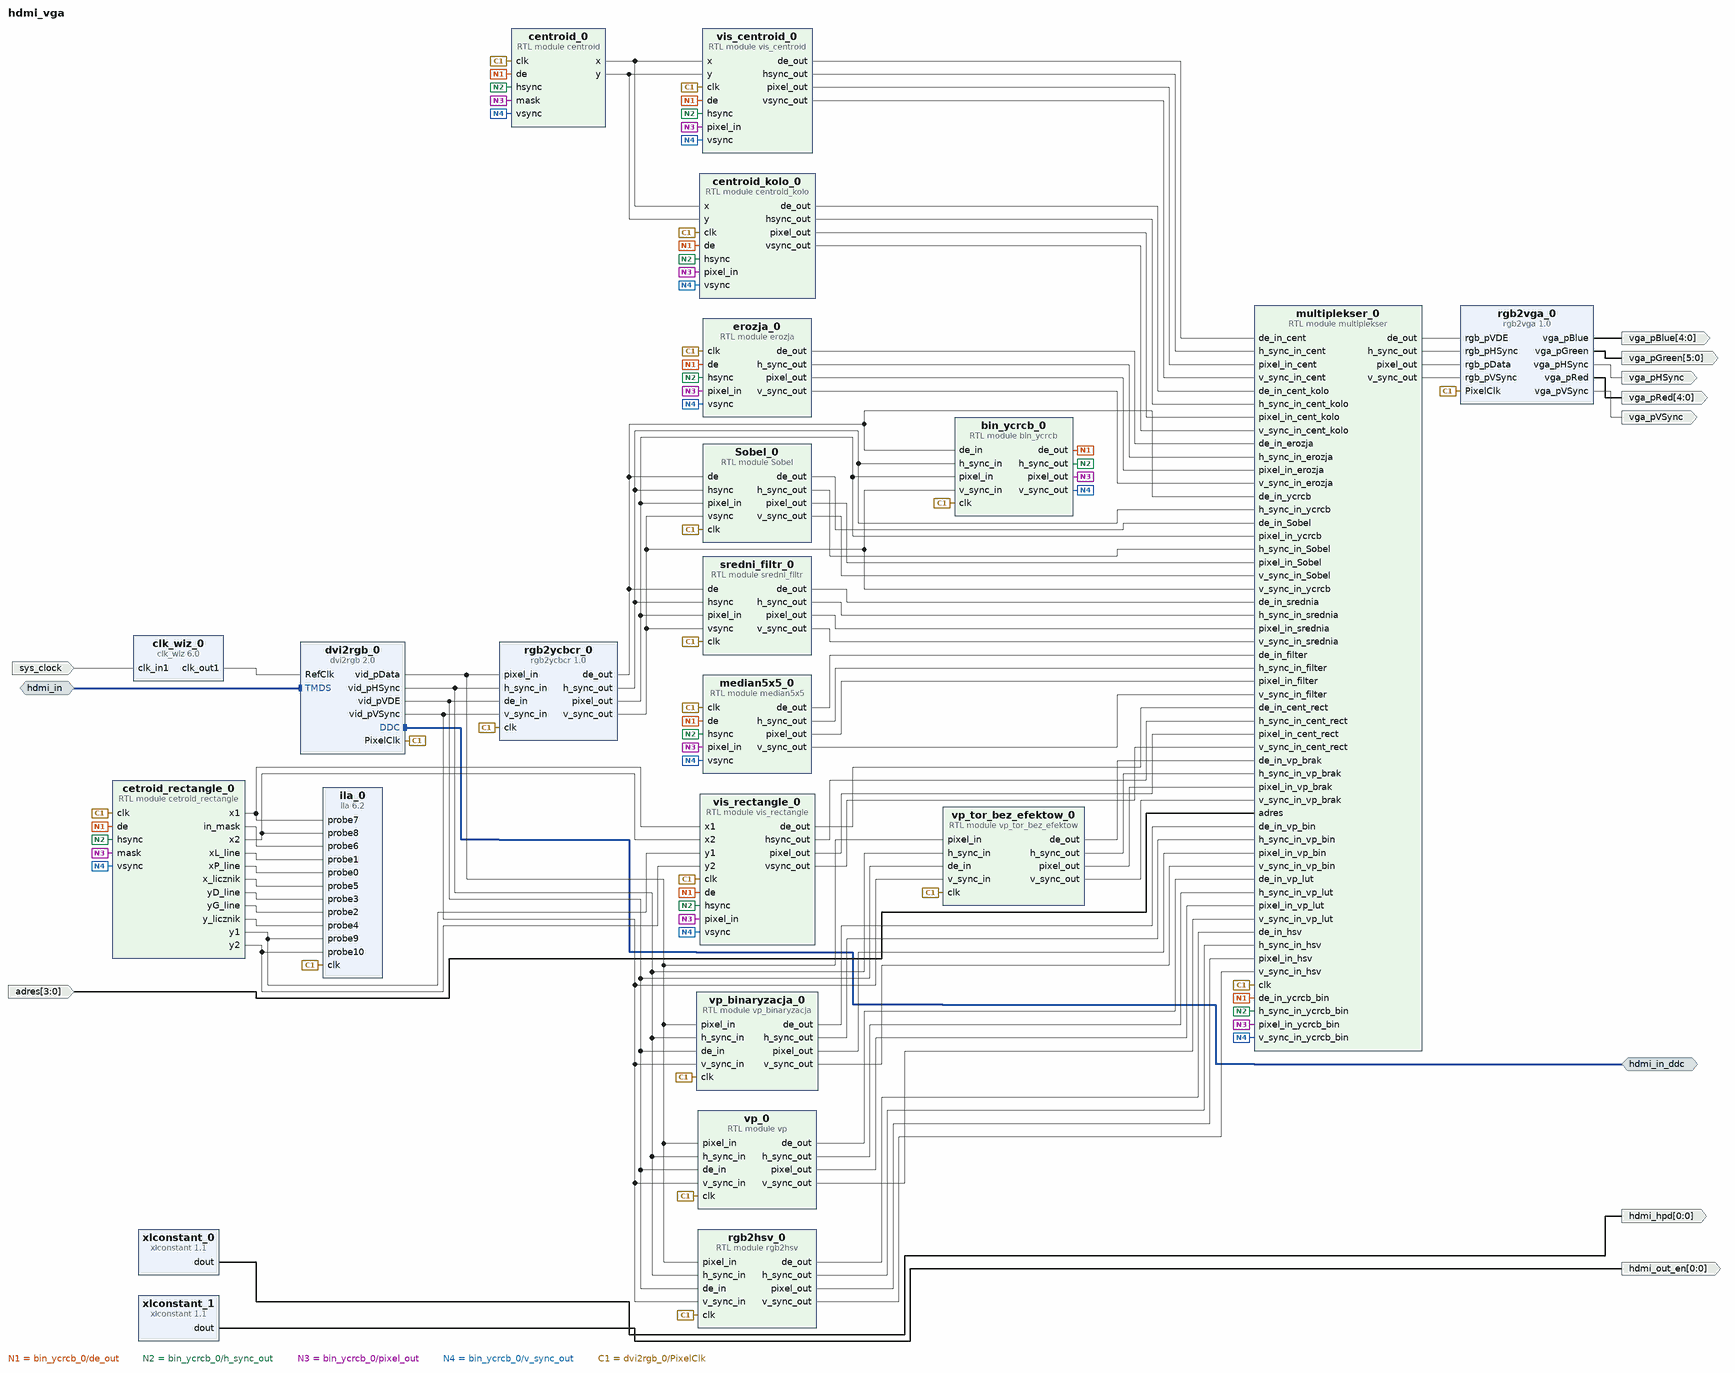
[diagram p0: block diagram of the top level]
# Vivado block design hdmi_vga, xc7z010clg400-1, Vivado 2022.2
create_bd_design hdmi_vga

create_bd_intf_port -mode Slave -vlnv digilentinc.com:interface:tmds_rtl:1.0 hdmi_in
create_bd_intf_port -mode Master -vlnv xilinx.com:interface:iic_rtl:1.0 hdmi_in_ddc
create_bd_port -dir I -type clk sys_clock
set_property -dict {CONFIG.FREQ_HZ 125000000} [get_bd_ports sys_clock]
create_bd_port -dir O -from 4 -to 0 vga_pRed
create_bd_port -dir O -from 5 -to 0 vga_pGreen
create_bd_port -dir O -from 4 -to 0 vga_pBlue
create_bd_port -dir O vga_pHSync
create_bd_port -dir O vga_pVSync
create_bd_port -dir O -from 0 -to 0 hdmi_hpd
create_bd_port -dir O -from 0 -to 0 hdmi_out_en
create_bd_port -dir I -from 3 -to 0 -type data adres

create_bd_cell -type ip -vlnv digilentinc.com:ip:dvi2rgb:2.0 dvi2rgb_0
create_bd_cell -type ip -vlnv xilinx.com:ip:clk_wiz:6.0 clk_wiz_0
set_property -dict [list \
  CONFIG.CLKOUT1_DRIVES BUFG \
  CONFIG.CLKOUT1_JITTER 109.241 \
  CONFIG.CLKOUT1_PHASE_ERROR 96.948 \
  CONFIG.CLKOUT1_REQUESTED_OUT_FREQ 200.000 \
  CONFIG.CLKOUT2_DRIVES BUFG \
  CONFIG.CLKOUT3_DRIVES BUFG \
  CONFIG.CLKOUT4_DRIVES BUFG \
  CONFIG.CLKOUT5_DRIVES BUFG \
  CONFIG.CLKOUT6_DRIVES BUFG \
  CONFIG.CLKOUT7_DRIVES BUFG \
  CONFIG.MMCM_BANDWIDTH OPTIMIZED \
  CONFIG.MMCM_CLKFBOUT_MULT_F 8 \
  CONFIG.MMCM_CLKOUT0_DIVIDE_F 5 \
  CONFIG.MMCM_COMPENSATION ZHOLD \
  CONFIG.PRIMITIVE PLL \
  CONFIG.USE_LOCKED false \
  CONFIG.USE_RESET false \
] [get_bd_cells clk_wiz_0]
create_bd_cell -type ip -vlnv digilentinc.com:ip:rgb2vga:1.0 rgb2vga_0
create_bd_cell -type ip -vlnv xilinx.com:ip:xlconstant:1.1 xlconstant_0
create_bd_cell -type ip -vlnv xilinx.com:ip:xlconstant:1.1 xlconstant_1
set_property -dict {CONFIG.CONST_VAL 0} [get_bd_cells xlconstant_1]
create_bd_cell -type module -reference vp vp_0
create_bd_cell -type module -reference vp_tor_bez_efektow vp_tor_bez_efektow_0
create_bd_cell -type module -reference vp_binaryzacja vp_binaryzacja_0
create_bd_cell -type ip -vlnv xilinx.com:user:rgb2ycbcr:1.0 rgb2ycbcr_0
create_bd_cell -type module -reference vis_centroid vis_centroid_0
set_property -dict {CONFIG.IMG_H 720 CONFIG.IMG_W 1280} [get_bd_cells vis_centroid_0]
create_bd_cell -type module -reference centroid centroid_0
set_property -dict {CONFIG.IMG_H 720 CONFIG.IMG_W 1280} [get_bd_cells centroid_0]
create_bd_cell -type module -reference centroid_kolo centroid_kolo_0
set_property -dict {CONFIG.IMG_H 720 CONFIG.IMG_W 1280 CONFIG.RADIUS 15 CONFIG.RADIUS_POWER2 225} [get_bd_cells centroid_kolo_0]
create_bd_cell -type module -reference vis_rectangle vis_rectangle_0
set_property -dict {CONFIG.IMG_H 720 CONFIG.IMG_W 1280} [get_bd_cells vis_rectangle_0]
create_bd_cell -type ip -vlnv xilinx.com:ip:ila:6.2 ila_0
set_property -dict [list \
  CONFIG.C_MONITOR_TYPE Native \
  CONFIG.C_NUM_OF_PROBES 11 \
  CONFIG.C_PROBE0_WIDTH 12 \
  CONFIG.C_PROBE10_WIDTH 12 \
  CONFIG.C_PROBE1_WIDTH 12 \
  CONFIG.C_PROBE2_WIDTH 12 \
  CONFIG.C_PROBE3_WIDTH 12 \
  CONFIG.C_PROBE4_WIDTH 12 \
  CONFIG.C_PROBE5_WIDTH 12 \
  CONFIG.C_PROBE7_WIDTH 12 \
  CONFIG.C_PROBE8_WIDTH 12 \
  CONFIG.C_PROBE9_WIDTH 12 \
] [get_bd_cells ila_0]
create_bd_cell -type module -reference cetroid_rectangle cetroid_rectangle_0
set_property -dict {CONFIG.IMG_H 720 CONFIG.IMG_W 1280} [get_bd_cells cetroid_rectangle_0]
create_bd_cell -type module -reference bin_ycrcb bin_ycrcb_0
create_bd_cell -type module -reference median5x5 median5x5_0
set_property -dict {CONFIG.H_SIZE 1650} [get_bd_cells median5x5_0]
create_bd_cell -type module -reference Sobel Sobel_0
set_property -dict {CONFIG.H_SIZE 1650} [get_bd_cells Sobel_0]
create_bd_cell -type module -reference sredni_filtr sredni_filtr_0
set_property -dict {CONFIG.H_SIZE 1650} [get_bd_cells sredni_filtr_0]
create_bd_cell -type module -reference rgb2hsv rgb2hsv_0
create_bd_cell -type module -reference multiplekser multiplekser_0
create_bd_cell -type module -reference erozja erozja_0
set_property -dict {CONFIG.H_SIZE 1650} [get_bd_cells erozja_0]

# ---- connections ----

connect_bd_intf_net [get_bd_intf_ports hdmi_in_ddc] [get_bd_intf_pins dvi2rgb_0/DDC]
connect_bd_intf_net [get_bd_intf_ports hdmi_in] [get_bd_intf_pins dvi2rgb_0/TMDS]
connect_bd_net [get_bd_pins Sobel_0/de_out] [get_bd_pins multiplekser_0/de_in_Sobel]
connect_bd_net [get_bd_pins Sobel_0/h_sync_out] [get_bd_pins multiplekser_0/h_sync_in_Sobel]
connect_bd_net [get_bd_pins Sobel_0/pixel_out] [get_bd_pins multiplekser_0/pixel_in_Sobel]
connect_bd_net [get_bd_pins Sobel_0/v_sync_out] [get_bd_pins multiplekser_0/v_sync_in_Sobel]
connect_bd_net [get_bd_ports adres] [get_bd_pins multiplekser_0/adres]
connect_bd_net [get_bd_pins bin_ycrcb_0/de_out] \
  [get_bd_pins vis_centroid_0/de] [get_bd_pins centroid_0/de] [get_bd_pins centroid_kolo_0/de] \
  [get_bd_pins vis_rectangle_0/de] [get_bd_pins cetroid_rectangle_0/de] [get_bd_pins median5x5_0/de] \
  [get_bd_pins multiplekser_0/de_in_ycrcb_bin] [get_bd_pins erozja_0/de]
connect_bd_net [get_bd_pins bin_ycrcb_0/h_sync_out] \
  [get_bd_pins vis_centroid_0/hsync] [get_bd_pins centroid_kolo_0/hsync] [get_bd_pins centroid_0/hsync] \
  [get_bd_pins vis_rectangle_0/hsync] [get_bd_pins cetroid_rectangle_0/hsync] [get_bd_pins median5x5_0/hsync] \
  [get_bd_pins multiplekser_0/h_sync_in_ycrcb_bin] [get_bd_pins erozja_0/hsync]
connect_bd_net [get_bd_pins bin_ycrcb_0/pixel_out] \
  [get_bd_pins vis_centroid_0/pixel_in] [get_bd_pins centroid_0/mask] [get_bd_pins centroid_kolo_0/pixel_in] \
  [get_bd_pins vis_rectangle_0/pixel_in] [get_bd_pins cetroid_rectangle_0/mask] [get_bd_pins median5x5_0/pixel_in] \
  [get_bd_pins multiplekser_0/pixel_in_ycrcb_bin] [get_bd_pins erozja_0/pixel_in]
connect_bd_net [get_bd_pins bin_ycrcb_0/v_sync_out] \
  [get_bd_pins vis_centroid_0/vsync] [get_bd_pins centroid_0/vsync] [get_bd_pins centroid_kolo_0/vsync] \
  [get_bd_pins vis_rectangle_0/vsync] [get_bd_pins cetroid_rectangle_0/vsync] [get_bd_pins median5x5_0/vsync] \
  [get_bd_pins multiplekser_0/v_sync_in_ycrcb_bin] [get_bd_pins erozja_0/vsync]
connect_bd_net [get_bd_pins centroid_0/x] [get_bd_pins vis_centroid_0/x] [get_bd_pins centroid_kolo_0/x]
connect_bd_net [get_bd_pins centroid_0/y] [get_bd_pins vis_centroid_0/y] [get_bd_pins centroid_kolo_0/y]
connect_bd_net [get_bd_pins centroid_kolo_0/de_out] [get_bd_pins multiplekser_0/de_in_cent_kolo]
connect_bd_net [get_bd_pins centroid_kolo_0/hsync_out] [get_bd_pins multiplekser_0/h_sync_in_cent_kolo]
connect_bd_net [get_bd_pins centroid_kolo_0/pixel_out] [get_bd_pins multiplekser_0/pixel_in_cent_kolo]
connect_bd_net [get_bd_pins centroid_kolo_0/vsync_out] [get_bd_pins multiplekser_0/v_sync_in_cent_kolo]
connect_bd_net [get_bd_pins cetroid_rectangle_0/in_mask] [get_bd_pins ila_0/probe6]
connect_bd_net [get_bd_pins cetroid_rectangle_0/x1] [get_bd_pins vis_rectangle_0/x1] [get_bd_pins ila_0/probe7]
connect_bd_net [get_bd_pins cetroid_rectangle_0/x2] [get_bd_pins vis_rectangle_0/x2] [get_bd_pins ila_0/probe8]
connect_bd_net [get_bd_pins cetroid_rectangle_0/xL_line] [get_bd_pins ila_0/probe1]
connect_bd_net [get_bd_pins cetroid_rectangle_0/xP_line] [get_bd_pins ila_0/probe0]
connect_bd_net [get_bd_pins cetroid_rectangle_0/x_licznik] [get_bd_pins ila_0/probe5]
connect_bd_net [get_bd_pins cetroid_rectangle_0/y1] [get_bd_pins vis_rectangle_0/y1] [get_bd_pins ila_0/probe9]
connect_bd_net [get_bd_pins cetroid_rectangle_0/y2] [get_bd_pins vis_rectangle_0/y2] [get_bd_pins ila_0/probe10]
connect_bd_net [get_bd_pins cetroid_rectangle_0/yD_line] [get_bd_pins ila_0/probe3]
connect_bd_net [get_bd_pins cetroid_rectangle_0/yG_line] [get_bd_pins ila_0/probe2]
connect_bd_net [get_bd_pins cetroid_rectangle_0/y_licznik] [get_bd_pins ila_0/probe4]
connect_bd_net [get_bd_pins clk_wiz_0/clk_out1] [get_bd_pins dvi2rgb_0/RefClk]
connect_bd_net [get_bd_pins dvi2rgb_0/PixelClk] \
  [get_bd_pins rgb2vga_0/PixelClk] [get_bd_pins rgb2ycbcr_0/clk] [get_bd_pins vp_binaryzacja_0/clk] \
  [get_bd_pins vp_tor_bez_efektow_0/clk] [get_bd_pins vp_0/clk] [get_bd_pins vis_centroid_0/clk] [get_bd_pins centroid_0/clk] \
  [get_bd_pins centroid_kolo_0/clk] [get_bd_pins vis_rectangle_0/clk] [get_bd_pins ila_0/clk] \
  [get_bd_pins cetroid_rectangle_0/clk] [get_bd_pins bin_ycrcb_0/clk] [get_bd_pins median5x5_0/clk] [get_bd_pins Sobel_0/clk] \
  [get_bd_pins sredni_filtr_0/clk] [get_bd_pins rgb2hsv_0/clk] [get_bd_pins multiplekser_0/clk] [get_bd_pins erozja_0/clk]
connect_bd_net [get_bd_pins dvi2rgb_0/vid_pData] \
  [get_bd_pins vp_0/pixel_in] [get_bd_pins vp_tor_bez_efektow_0/pixel_in] [get_bd_pins vp_binaryzacja_0/pixel_in] \
  [get_bd_pins rgb2ycbcr_0/pixel_in] [get_bd_pins rgb2hsv_0/pixel_in]
connect_bd_net [get_bd_pins dvi2rgb_0/vid_pHSync] \
  [get_bd_pins vp_0/h_sync_in] [get_bd_pins vp_tor_bez_efektow_0/h_sync_in] [get_bd_pins vp_binaryzacja_0/h_sync_in] \
  [get_bd_pins rgb2ycbcr_0/h_sync_in] [get_bd_pins rgb2hsv_0/h_sync_in]
connect_bd_net [get_bd_pins dvi2rgb_0/vid_pVDE] \
  [get_bd_pins vp_0/de_in] [get_bd_pins vp_tor_bez_efektow_0/de_in] [get_bd_pins vp_binaryzacja_0/de_in] \
  [get_bd_pins rgb2ycbcr_0/de_in] [get_bd_pins rgb2hsv_0/de_in]
connect_bd_net [get_bd_pins dvi2rgb_0/vid_pVSync] \
  [get_bd_pins vp_0/v_sync_in] [get_bd_pins vp_tor_bez_efektow_0/v_sync_in] [get_bd_pins vp_binaryzacja_0/v_sync_in] \
  [get_bd_pins rgb2ycbcr_0/v_sync_in] [get_bd_pins rgb2hsv_0/v_sync_in]
connect_bd_net [get_bd_pins erozja_0/de_out] [get_bd_pins multiplekser_0/de_in_erozja]
connect_bd_net [get_bd_pins erozja_0/h_sync_out] [get_bd_pins multiplekser_0/h_sync_in_erozja]
connect_bd_net [get_bd_pins erozja_0/pixel_out] [get_bd_pins multiplekser_0/pixel_in_erozja]
connect_bd_net [get_bd_pins erozja_0/v_sync_out] [get_bd_pins multiplekser_0/v_sync_in_erozja]
connect_bd_net [get_bd_pins median5x5_0/de_out] [get_bd_pins multiplekser_0/de_in_filter]
connect_bd_net [get_bd_pins median5x5_0/h_sync_out] [get_bd_pins multiplekser_0/h_sync_in_filter]
connect_bd_net [get_bd_pins median5x5_0/pixel_out] [get_bd_pins multiplekser_0/pixel_in_filter]
connect_bd_net [get_bd_pins median5x5_0/v_sync_out] [get_bd_pins multiplekser_0/v_sync_in_filter]
connect_bd_net [get_bd_pins multiplekser_0/de_out] [get_bd_pins rgb2vga_0/rgb_pVDE]
connect_bd_net [get_bd_pins multiplekser_0/h_sync_out] [get_bd_pins rgb2vga_0/rgb_pHSync]
connect_bd_net [get_bd_pins multiplekser_0/pixel_out] [get_bd_pins rgb2vga_0/rgb_pData]
connect_bd_net [get_bd_pins multiplekser_0/v_sync_out] [get_bd_pins rgb2vga_0/rgb_pVSync]
connect_bd_net [get_bd_pins rgb2hsv_0/de_out] [get_bd_pins multiplekser_0/de_in_hsv]
connect_bd_net [get_bd_pins rgb2hsv_0/h_sync_out] [get_bd_pins multiplekser_0/h_sync_in_hsv]
connect_bd_net [get_bd_pins rgb2hsv_0/pixel_out] [get_bd_pins multiplekser_0/pixel_in_hsv]
connect_bd_net [get_bd_pins rgb2hsv_0/v_sync_out] [get_bd_pins multiplekser_0/v_sync_in_hsv]
connect_bd_net [get_bd_pins rgb2vga_0/vga_pBlue] [get_bd_ports vga_pBlue]
connect_bd_net [get_bd_pins rgb2vga_0/vga_pGreen] [get_bd_ports vga_pGreen]
connect_bd_net [get_bd_pins rgb2vga_0/vga_pHSync] [get_bd_ports vga_pHSync]
connect_bd_net [get_bd_pins rgb2vga_0/vga_pRed] [get_bd_ports vga_pRed]
connect_bd_net [get_bd_pins rgb2vga_0/vga_pVSync] [get_bd_ports vga_pVSync]
connect_bd_net [get_bd_pins rgb2ycbcr_0/de_out] \
  [get_bd_pins bin_ycrcb_0/de_in] [get_bd_pins Sobel_0/de] [get_bd_pins sredni_filtr_0/de] \
  [get_bd_pins multiplekser_0/de_in_ycrcb]
connect_bd_net [get_bd_pins rgb2ycbcr_0/h_sync_out] \
  [get_bd_pins bin_ycrcb_0/h_sync_in] [get_bd_pins Sobel_0/hsync] [get_bd_pins sredni_filtr_0/hsync] \
  [get_bd_pins multiplekser_0/h_sync_in_ycrcb]
connect_bd_net [get_bd_pins rgb2ycbcr_0/pixel_out] \
  [get_bd_pins bin_ycrcb_0/pixel_in] [get_bd_pins Sobel_0/pixel_in] [get_bd_pins sredni_filtr_0/pixel_in] \
  [get_bd_pins multiplekser_0/pixel_in_ycrcb]
connect_bd_net [get_bd_pins rgb2ycbcr_0/v_sync_out] \
  [get_bd_pins bin_ycrcb_0/v_sync_in] [get_bd_pins Sobel_0/vsync] [get_bd_pins sredni_filtr_0/vsync] \
  [get_bd_pins multiplekser_0/v_sync_in_ycrcb]
connect_bd_net [get_bd_pins sredni_filtr_0/de_out] [get_bd_pins multiplekser_0/de_in_srednia]
connect_bd_net [get_bd_pins sredni_filtr_0/h_sync_out] [get_bd_pins multiplekser_0/h_sync_in_srednia]
connect_bd_net [get_bd_pins sredni_filtr_0/pixel_out] [get_bd_pins multiplekser_0/pixel_in_srednia]
connect_bd_net [get_bd_pins sredni_filtr_0/v_sync_out] [get_bd_pins multiplekser_0/v_sync_in_srednia]
connect_bd_net [get_bd_ports sys_clock] [get_bd_pins clk_wiz_0/clk_in1]
connect_bd_net [get_bd_pins vis_centroid_0/de_out] [get_bd_pins multiplekser_0/de_in_cent]
connect_bd_net [get_bd_pins vis_centroid_0/hsync_out] [get_bd_pins multiplekser_0/h_sync_in_cent]
connect_bd_net [get_bd_pins vis_centroid_0/pixel_out] [get_bd_pins multiplekser_0/pixel_in_cent]
connect_bd_net [get_bd_pins vis_centroid_0/vsync_out] [get_bd_pins multiplekser_0/v_sync_in_cent]
connect_bd_net [get_bd_pins vis_rectangle_0/de_out] [get_bd_pins multiplekser_0/de_in_cent_rect]
connect_bd_net [get_bd_pins vis_rectangle_0/hsync_out] [get_bd_pins multiplekser_0/h_sync_in_cent_rect]
connect_bd_net [get_bd_pins vis_rectangle_0/pixel_out] [get_bd_pins multiplekser_0/pixel_in_cent_rect]
connect_bd_net [get_bd_pins vis_rectangle_0/vsync_out] [get_bd_pins multiplekser_0/v_sync_in_cent_rect]
connect_bd_net [get_bd_pins vp_0/de_out] [get_bd_pins multiplekser_0/de_in_vp_lut]
connect_bd_net [get_bd_pins vp_0/h_sync_out] [get_bd_pins multiplekser_0/h_sync_in_vp_lut]
connect_bd_net [get_bd_pins vp_0/pixel_out] [get_bd_pins multiplekser_0/pixel_in_vp_lut]
connect_bd_net [get_bd_pins vp_0/v_sync_out] [get_bd_pins multiplekser_0/v_sync_in_vp_lut]
connect_bd_net [get_bd_pins vp_binaryzacja_0/de_out] [get_bd_pins multiplekser_0/de_in_vp_bin]
connect_bd_net [get_bd_pins vp_binaryzacja_0/h_sync_out] [get_bd_pins multiplekser_0/h_sync_in_vp_bin]
connect_bd_net [get_bd_pins vp_binaryzacja_0/pixel_out] [get_bd_pins multiplekser_0/pixel_in_vp_bin]
connect_bd_net [get_bd_pins vp_binaryzacja_0/v_sync_out] [get_bd_pins multiplekser_0/v_sync_in_vp_bin]
connect_bd_net [get_bd_pins vp_tor_bez_efektow_0/de_out] [get_bd_pins multiplekser_0/de_in_vp_brak]
connect_bd_net [get_bd_pins vp_tor_bez_efektow_0/h_sync_out] [get_bd_pins multiplekser_0/h_sync_in_vp_brak]
connect_bd_net [get_bd_pins vp_tor_bez_efektow_0/pixel_out] [get_bd_pins multiplekser_0/pixel_in_vp_brak]
connect_bd_net [get_bd_pins vp_tor_bez_efektow_0/v_sync_out] [get_bd_pins multiplekser_0/v_sync_in_vp_brak]
connect_bd_net [get_bd_pins xlconstant_0/dout] [get_bd_ports hdmi_hpd]
connect_bd_net [get_bd_pins xlconstant_1/dout] [get_bd_ports hdmi_out_en]

validate_bd_design
save_bd_design
